# EAGLE design Urzeitcode-18F16Q41-2 (EAGLE 7.2.0)
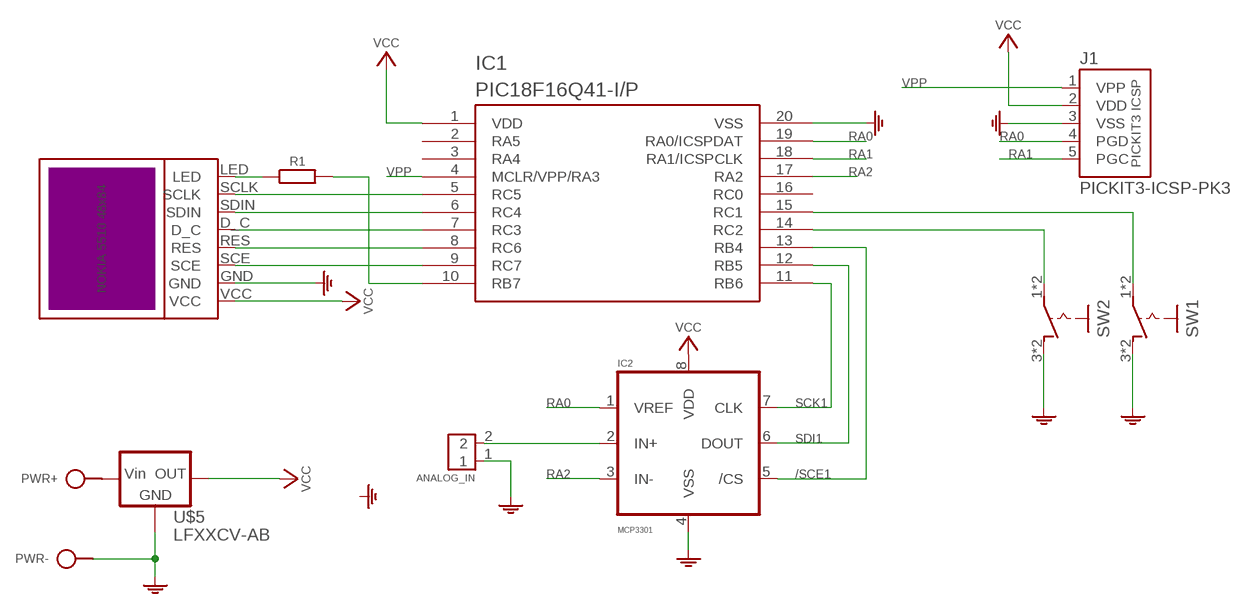
[diagram p0: schematic, sheet 1]

## Parts
ANALOG_IN  CONN-2P2P/H  [CONN-2P]
IC1  PIC18F16Q41-I/P  [DIL20-3/V]
IC2  MCP3301  [DIL08]
J1  PICKIT3-ICSP-PK3  [PIC-PK3]
PWR  SPAD+--+  [SPAD-+]
R1  R-H0204/15-V  [0204/15-V]
SW1  PB-1P-1T2P1T  [PB-2P1T]
SW2  PB-1P-1T2P1T  [PB-2P1T]
U$2  NOKIA-5510-48X84-MODULE  [MOD-LCD5110]
U$5  LFXXCV-AB  [TO220AB]

## Nets
/SCE1: IC1.13(RB4) IC2.5(/CS)
GND: ANALOG_IN.1 IC1.20(VSS) IC2.4(VSS) J1.3(VSS) PWR.1 SW1.3(S) SW1.4(S) SW2.3(S) SW2.4(S) U$2.GND U$5.2(GND)
N$1: PWR.2 U$5.1(VIN)
N$2: ANALOG_IN.2 IC2.2(IN+)
N$6: R1.1 U$2.LED
N$11: IC1.14(RC2) SW2.1(P) SW2.2(P)
N$12: IC1.15(RC1) SW1.1(P) SW1.2(P)
RA0: IC1.19(RA0/ICSPDAT) IC2.1(VREF) J1.4(PGD)
RA1: IC1.18(RA1/ICSPCLK) J1.5(PGC)
RA2: IC1.17(RA2) IC2.3(IN-)
RB7: IC1.10(RB7) R1.2
RC3: IC1.7(RC3) U$2.D_C
RC4: IC1.6(RC4) U$2.SDIN
RC5: IC1.5(RC5) U$2.SCLK
RC6: IC1.8(RC6) U$2.RES
RC7: IC1.9(RC7) U$2.SCE
SCK1: IC1.11(RB6) IC2.7(CLK)
SDI1: IC1.12(RB5) IC2.6(DOUT)
VCC: IC1.1(VDD) IC2.8(VDD) J1.2(VDD) U$2.VCC U$5.3(VOUT)
VPP: IC1.4(MCLR/VPP/RA3) J1.1(VPP)
Unconnected: IC1.2(RA5) IC1.3(RA4) IC1.16(RC0)

## Library data of the parts
ANALOG_IN = pinconn:CONN-2P
IC1 = mcu:PIC18F16Q41-I/P
IC2 = ic:MCP3301
J1 = pinconn:PICKIT3-ICSP
PWR = pad:SPAD+-
R1 = r:R-H
SW1 SW2 = sw:PB-1P-1T
U$2 = lcd:NOKIA-5510-48X84
U$5 = ic:LFXXCV

## Board
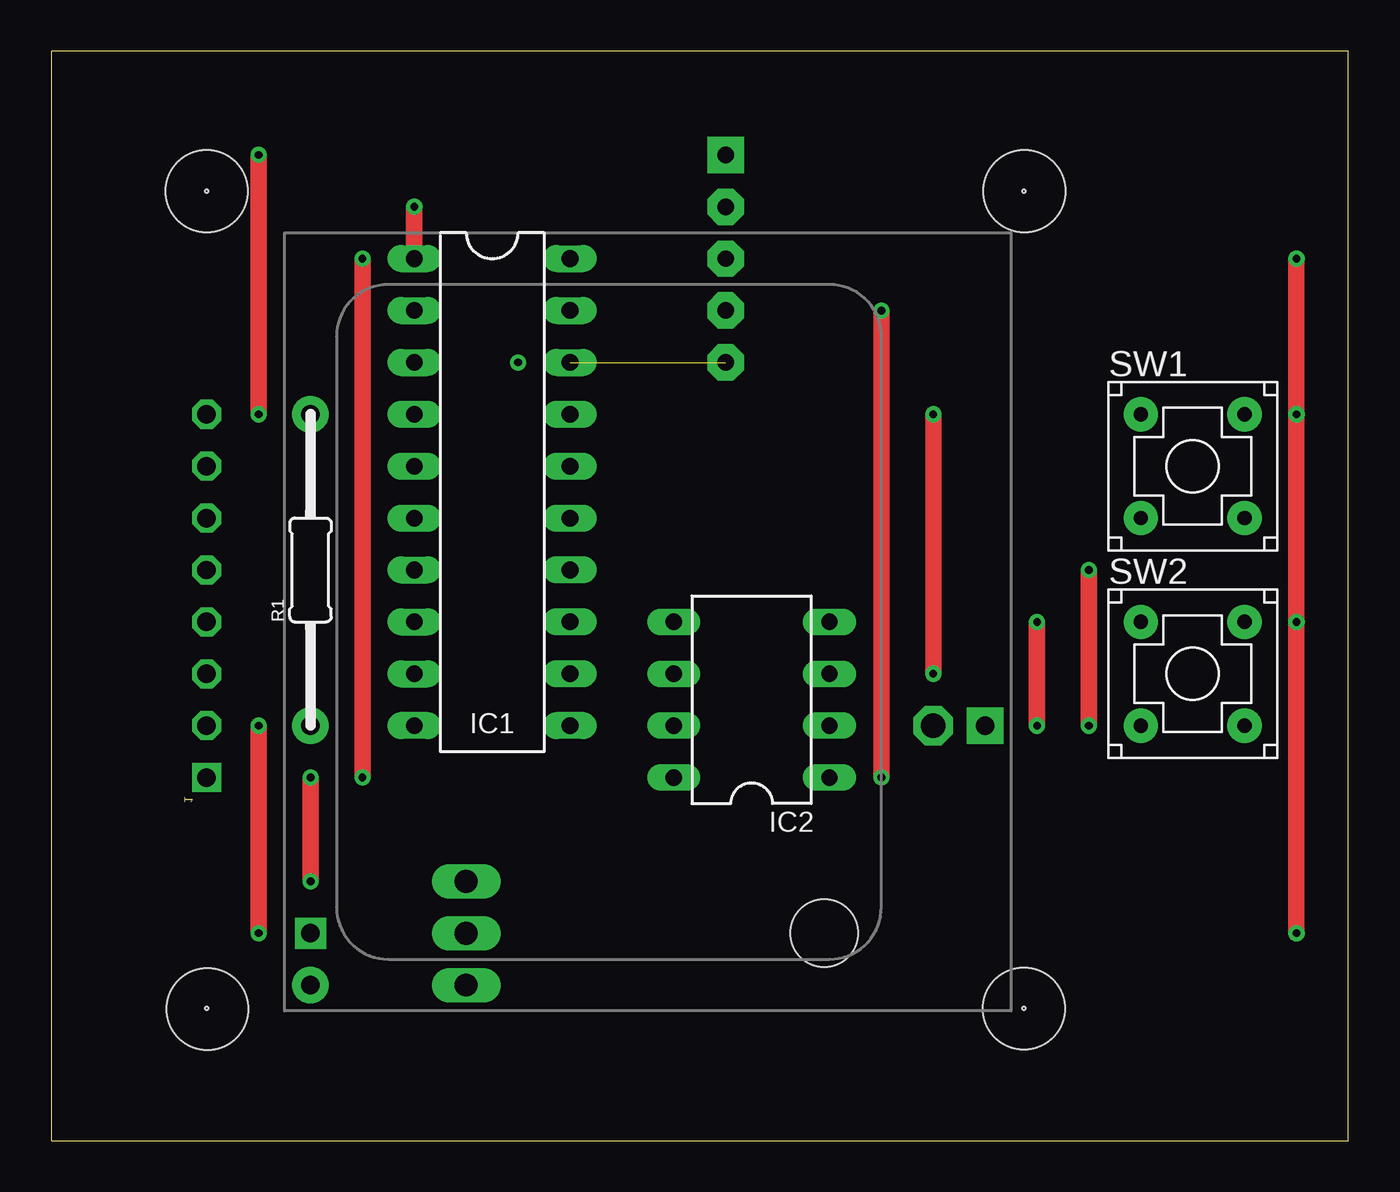
[diagram p1: board, top side]
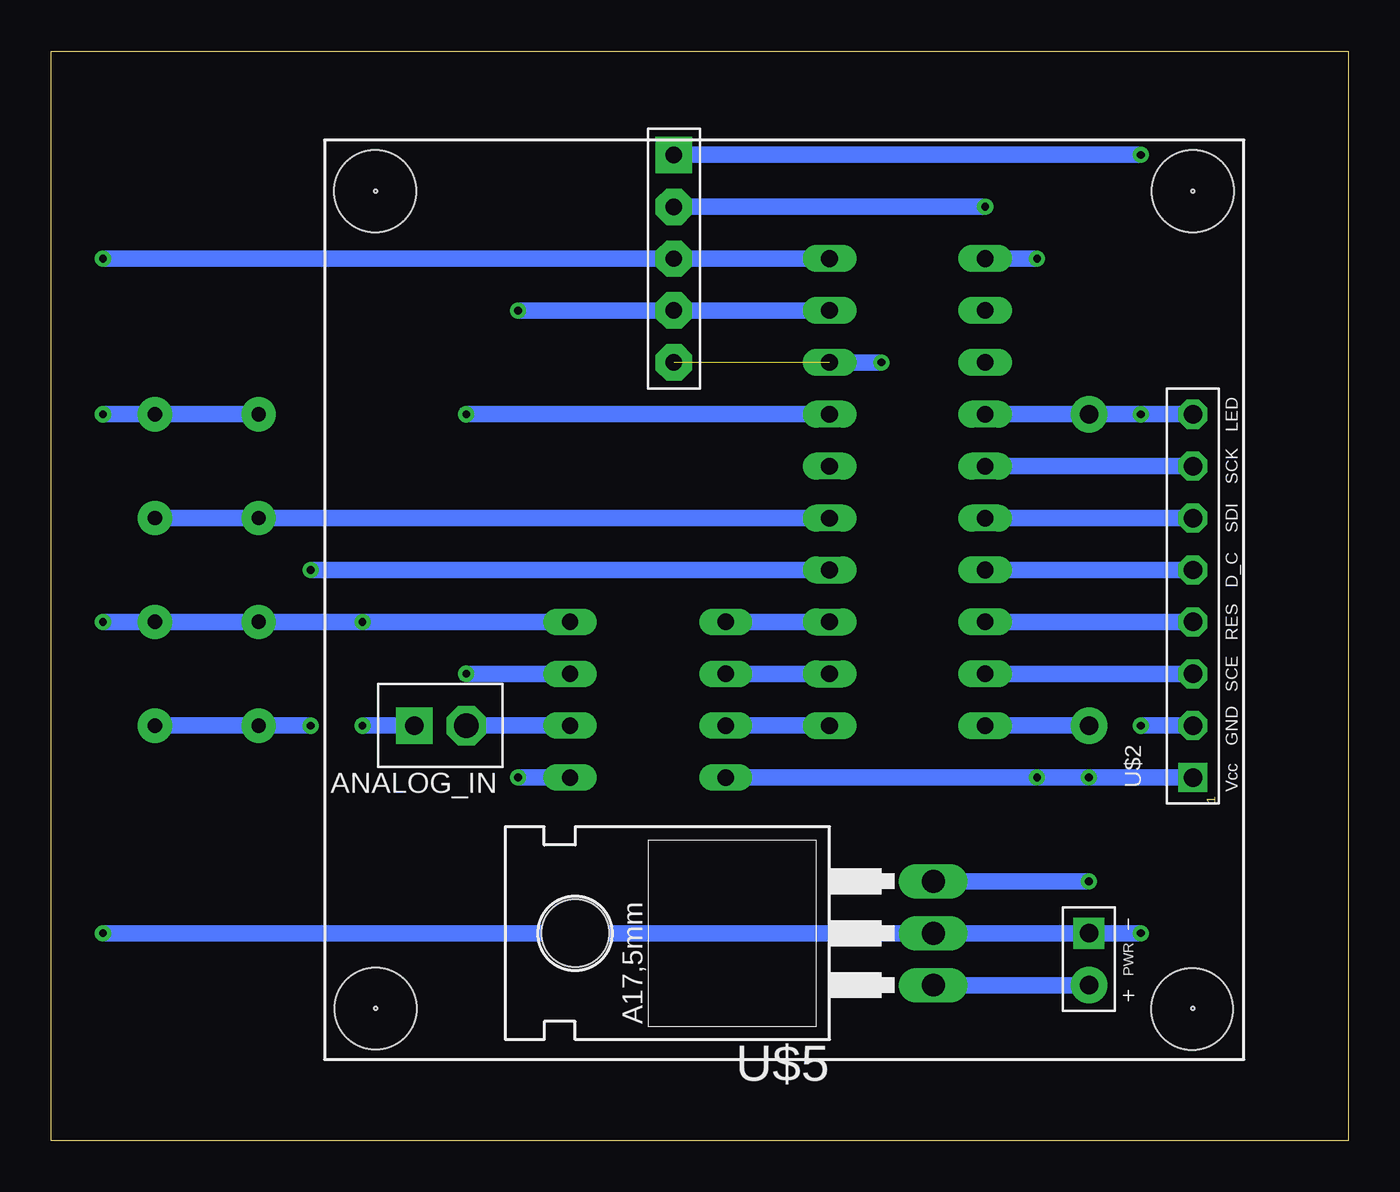
[diagram p2: board, bottom side, seen from below]

Size 63.5 x 53.34 mm. Coordinates in mm from the lower left corner, seen from the top.
Outline: 0,0 63.5,0 63.5,53.34 0,53.34 0,0
Copper layers (1*16): Top 0.035mm / dielectric 1.5mm / Bottom 0.035mm
Design rules "default": minimum track width 10mil, minimum drill 24mil, track to track 8mil, track to pad 8mil, pad to pad 8mil, via to via 8mil, smd to smd 8mil, copper to edge 40mil, drill to drill 8mil, minimum pad ring 10mil, minimum via ring 8mil, stop-mask expansion 4mil, vias tented up to drill 0mil, thermal gap 10mil
Holes 4 mm at 7.62,46.48 7.65,6.45 47.65,46.48 47.61,6.47

### Footprints (pad centres in the part's own frame; a part is rotated, then mirrored left to right if it is on the bottom)
CONN-2P = drill 0.9 pad 1.778 square: 1 0,0 | drill 1.2 pad 1.93 octagon: 2 -2.54,0
DIL20-3/V = drill 0.813 long: 1 -3.81,8.89; 2 -3.81,6.35; 3 -3.81,3.81; 4 -3.81,1.27; 5 -3.81,-1.27; 6 -3.81,-3.81; 7 -3.81,-6.35; 8 -3.81,-8.89; 9 -3.81,-11.43; 10 -3.81,-13.97; 11 3.81,-13.97; 12 3.81,-11.43; 13 3.81,-8.89; 14 3.81,-6.35; 15 3.81,-3.81; 16 3.81,-1.27; 17 3.81,1.27; 18 3.81,3.81; 19 3.81,6.35; 20 3.81,8.89
DIL08 = drill 0.8 pad 1.27 long: 1 -3.81,3.81; 2 -3.81,1.27; 3 -3.81,-1.27; 4 -3.81,-3.81; 5 3.81,-3.81; 6 3.81,-1.27; 7 3.81,1.27; 8 3.81,3.81
PIC-PK3 = drill 0.8 pad 1.778 square: 1 -5.08,0 | drill 0.8 pad 1.778 octagon: 2 -2.54,0; 3 0,0; 4 2.54,0; 5 5.08,0
SPAD-+ = drill 0.9 pad 1.524 square: 1 0,-1.27 | drill 0.9 pad 1.778: 2 0,1.27
0204/15-V = drill 0.9 pad 1.778: 1 0,7.62; 2 0,-7.62
PB-2P1T = drill 0.7 pad 1.676: 1 2.54,-2.54; 2 -2.54,-2.54; 3 2.54,2.54; 4 -2.54,2.54
MOD-LCD5110 = drill 2.032 pad 2.54: 1 -19.809,19.05; 2 20.19,19.05; 3 -19.809,-20.95; 4 20.19,-20.95 | drill 0.9 pad 1.422 octagon: D_C -1.27,19.06; GND 6.35,19.06; LED -8.89,19.06; RES 1.27,19.06; SCE 3.81,19.06; SCLK -6.35,19.06; SDIN -3.81,19.06 | drill 0.9 pad 1.422 square: VCC 8.89,19.06 | hole 0.15: -19.809,19.05; 20.19,19.05; -19.81,-20.95; 20.19,-20.95
TO220AB = drill 1.118 long: 1 -2.54,-6.35; 2 0,-6.35; 3 2.54,-6.35 | hole 3.302: 0,11.176

### Placement (x,y rotation side)
ANALOG_IN  45.72,20.32 180 bottom
IC1  21.59,34.29 0 top
IC2  34.29,21.59 180 top
J1  33.02,43.18 270 top
PWR  12.7,8.89 180 bottom
R1  12.7,27.94 0 top
SW1  55.88,33.02 0 top
SW2  55.88,22.86 0 top
U$2  26.67,26.67 270 bottom
U$5  26.67,10.16 90 bottom

### Tracks (layer width: path | path; a pad name or v marks a point on that pad's centre or on a via)
/SCE1
  Bottom 0.813: IC2.5 IC1.13
GND  (via drill 0.38)
  Top 0.813: v60.96,43.18 v60.96,35.56 v60.96,25.4 v60.96,10.16 | v10.16,20.32 v10.16,10.16 | v48.26,20.32 v48.26,25.4
  Bottom 0.813: v60.96,43.18 J1.3 IC1.20 | IC2.4 v48.26,25.4 v60.96,25.4 SW2.4 SW2.3 | U$2.GND v10.16,20.32 | v60.96,10.16 U$5.2 PWR.1 v10.16,10.16 | v60.96,35.56 SW1.4 SW1.3 | ANALOG_IN.1 v48.26,20.32
N$1
  Bottom 0.813: PWR.2 U$5.1
N$2
  Bottom 0.813: ANALOG_IN.2 IC2.2
N$6
  Bottom 0.813: R1.1 U$2.LED
N$11  (via drill 0.38)
  Top 0.813: v50.8,20.32 v50.8,27.94
  Bottom 0.813: v50.8,27.94 IC1.14 | SW2.1 SW2.2 v50.8,20.32
N$12
  Bottom 0.813: IC1.15 SW1.2 SW1.1
RA0  (via drill 0.38)
  Top 0.813: v40.64,40.64 v40.64,17.78
  Bottom 0.813: IC1.19 J1.4 v40.64,40.64 | v40.64,17.78 IC2.1
RA1  (via drill 0.38)  (1 unrouted)
  Bottom 0.813: v22.86,38.1 IC1.18
RA2  (via drill 0.38)
  Top 0.813: v43.18,35.56 v43.18,22.86
  Bottom 0.813: IC1.17 v43.18,35.56 | v43.18,22.86 IC2.3
RB7
  Bottom 0.813: IC1.10 R1.2
RC3
  Bottom 0.813: IC1.7 U$2.D_C
RC4
  Bottom 0.813: U$2.SDIN IC1.6
RC5
  Bottom 0.813: IC1.5 U$2.SCLK
RC6
  Bottom 0.813: U$2.RES IC1.8
RC7
  Bottom 0.813: U$2.SCE IC1.9
SCK1
  Bottom 0.813: IC1.11 IC2.7
SDI1
  Bottom 0.813: IC1.12 IC2.6
VCC  (via drill 0.38)
  Top 0.813: v15.24,43.18 v15.24,17.78 | v12.7,12.7 v12.7,17.78 | v17.78,45.72 IC1.1
  Bottom 0.813: IC2.8 v12.7,17.78 v15.24,17.78 U$2.VCC | U$5.3 v12.7,12.7 | J1.2 v17.78,45.72 | v15.24,43.18 IC1.1
  other vias: 17.78,43.18 17.78,43.18
VPP  (via drill 0.38)
  Top 0.813: v10.16,35.56 v10.16,48.26
  Bottom 0.813: IC1.4 v10.16,35.56 | v10.16,48.26 J1.1